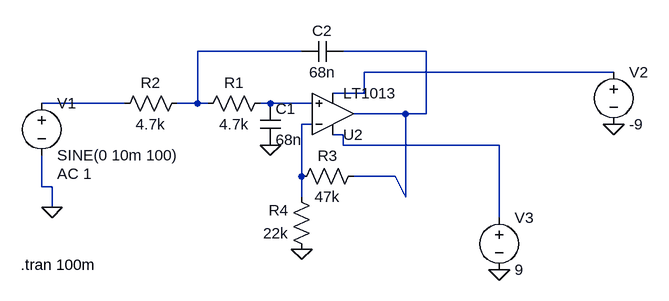
[diagram p0: schematic filter.asc]
filter.asc, the LTspice schematic file:
Version 4
SHEET 1 1136 680
WIRE 160 64 0 64
WIRE 352 64 224 64
WIRE 640 96 256 96
WIRE 256 128 256 96
WIRE 256 128 208 128
WIRE -112 144 -240 144
WIRE 0 144 0 64
WIRE 0 144 -32 144
WIRE 16 144 0 144
WIRE 112 144 96 144
WIRE 176 144 112 144
WIRE 320 160 240 160
WIRE 352 160 352 64
WIRE 352 160 320 160
WIRE 176 176 160 176
WIRE 224 192 208 192
WIRE 224 208 224 192
WIRE 464 208 224 208
WIRE 160 256 160 176
WIRE 304 256 240 256
WIRE -240 272 -240 224
WIRE -224 272 -240 272
WIRE 160 288 160 256
WIRE 320 288 320 160
WIRE 320 288 304 256
WIRE -224 304 -224 272
WIRE 464 320 464 208
FLAG 160 368 0
FLAG -224 304 0
FLAG 112 208 0
FLAG 464 400 0
FLAG 640 176 0
SYMBOL res 112 128 R90
WINDOW 0 0 56 VBottom 2
WINDOW 3 32 56 VTop 2
SYMATTR InstName R1
SYMATTR Value 4.7k
SYMBOL res -16 128 R90
WINDOW 0 0 56 VBottom 2
WINDOW 3 32 56 VTop 2
SYMATTR InstName R2
SYMATTR Value 4.7k
SYMBOL res 256 240 R90
WINDOW 0 0 56 VBottom 2
WINDOW 3 32 56 VTop 2
SYMATTR InstName R3
SYMATTR Value 47k
SYMBOL res 176 384 R180
WINDOW 0 36 76 Left 2
WINDOW 3 36 40 Left 2
SYMATTR InstName R4
SYMATTR Value 22k
SYMBOL cap 96 144 R0
SYMATTR InstName C1
SYMATTR Value 68n
SYMBOL cap 224 48 R90
WINDOW 0 0 32 VBottom 2
WINDOW 3 32 32 VTop 2
SYMATTR InstName C2
SYMATTR Value 68n
SYMBOL voltage -240 128 R0
WINDOW 123 24 124 Left 2
WINDOW 39 0 0 Left 0
SYMATTR InstName V1
SYMATTR Value SINE(0 10m 100)
SYMATTR Value2 AC 1
SYMBOL voltage 640 80 R0
WINDOW 123 0 0 Left 0
WINDOW 39 0 0 Left 0
SYMATTR InstName V2
SYMATTR Value -9
SYMBOL voltage 464 304 R0
WINDOW 123 0 0 Left 0
WINDOW 39 0 0 Left 0
SYMATTR InstName V3
SYMATTR Value 9
SYMBOL OpAmps\\LT1013 208 224 M180
SYMATTR InstName U2
TEXT -272 392 Left 2 !.tran 100m

The netlist it stands for:
* filter.asc
R1 N005 N001 4.7k
R2 N001 N004 4.7k
R3 N002 N006 47k
R4 0 N006 22k
C1 N005 0 68n
C2 N002 N001 68n
V1 N004 0 SINE(0 10m 100) AC 1
V2 N003 0 -9
V3 N007 0 9
XU2 N005 N006 N007 N003 N002 LT1013  ; pins In+ In- V+ V- OUT
.tran 100m
.lib LTC.lib
.backanno
.end